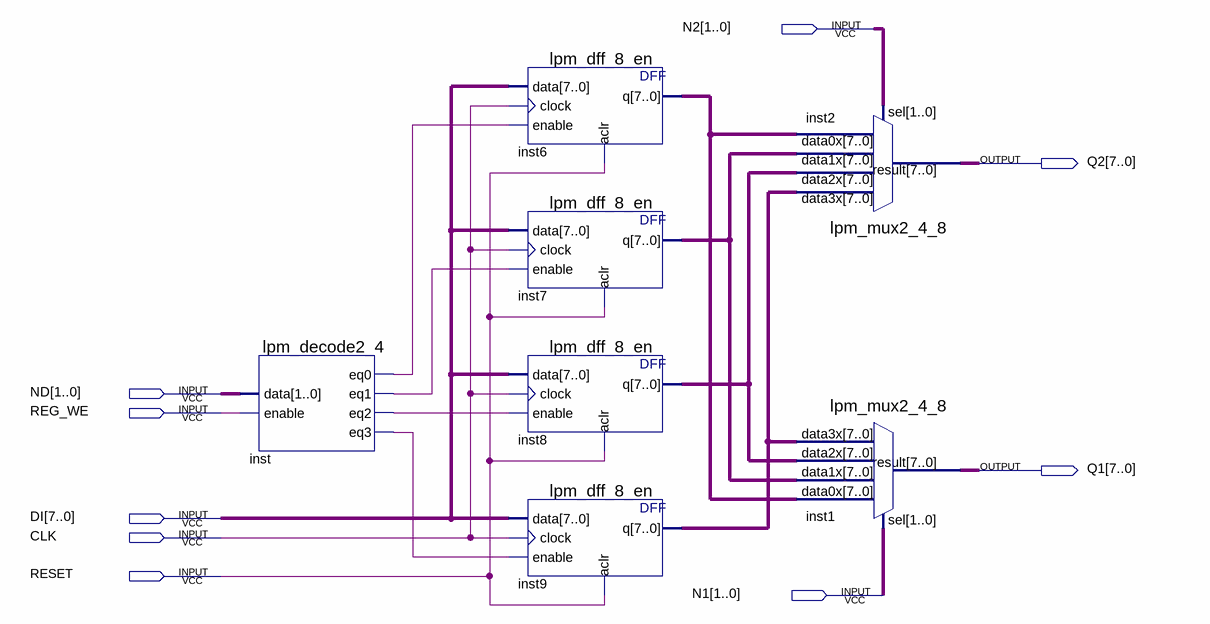
[diagram p0: schematic sheet]
// Quartus schematic reg4_8.bdf as structural Verilog: 7 symbols, 9 pins
module reg4_8 (
  input  [1:0] N2,
  input  [1:0] ND,
  input  REG_WE,
  input  [7:0] DI,
  input  CLK,
  input  RESET,
  input  [1:0] N1,
  output [7:0] Q2,
  output [7:0] Q1
);

  wire inst_eq0, inst_eq1, inst_eq2, inst_eq3;
  wire [7:0] inst6_q, inst7_q, inst8_q, inst9_q;

  lpm_decode2_4 inst (.data(ND), .enable(REG_WE), .eq0(inst_eq0), .eq1(inst_eq1), .eq2(inst_eq2), .eq3(inst_eq3));
  lpm_dff_8_en inst6 (.data(DI), .clock(CLK), .enable(inst_eq0), .aclr(RESET), .q(inst6_q));
  lpm_dff_8_en inst7 (.data(DI), .clock(CLK), .enable(inst_eq1), .aclr(RESET), .q(inst7_q));
  lpm_dff_8_en inst8 (.data(DI), .clock(CLK), .enable(inst_eq2), .aclr(RESET), .q(inst8_q));
  lpm_dff_8_en inst9 (.data(DI), .clock(CLK), .enable(inst_eq3), .aclr(RESET), .q(inst9_q));
  lpm_mux2_4_8 inst2 (.data3x(inst9_q), .data2x(inst8_q), .data1x(inst7_q), .data0x(inst6_q), .sel(N2), .result(Q2));
  lpm_mux2_4_8 inst1 (.data3x(inst9_q), .data2x(inst8_q), .data1x(inst7_q), .data0x(inst6_q), .sel(N1), .result(Q1));
endmodule
